# Altium schematic sheet iSystem.SchDoc
size A4; SheetNumber: 1; SheetTotal: 8
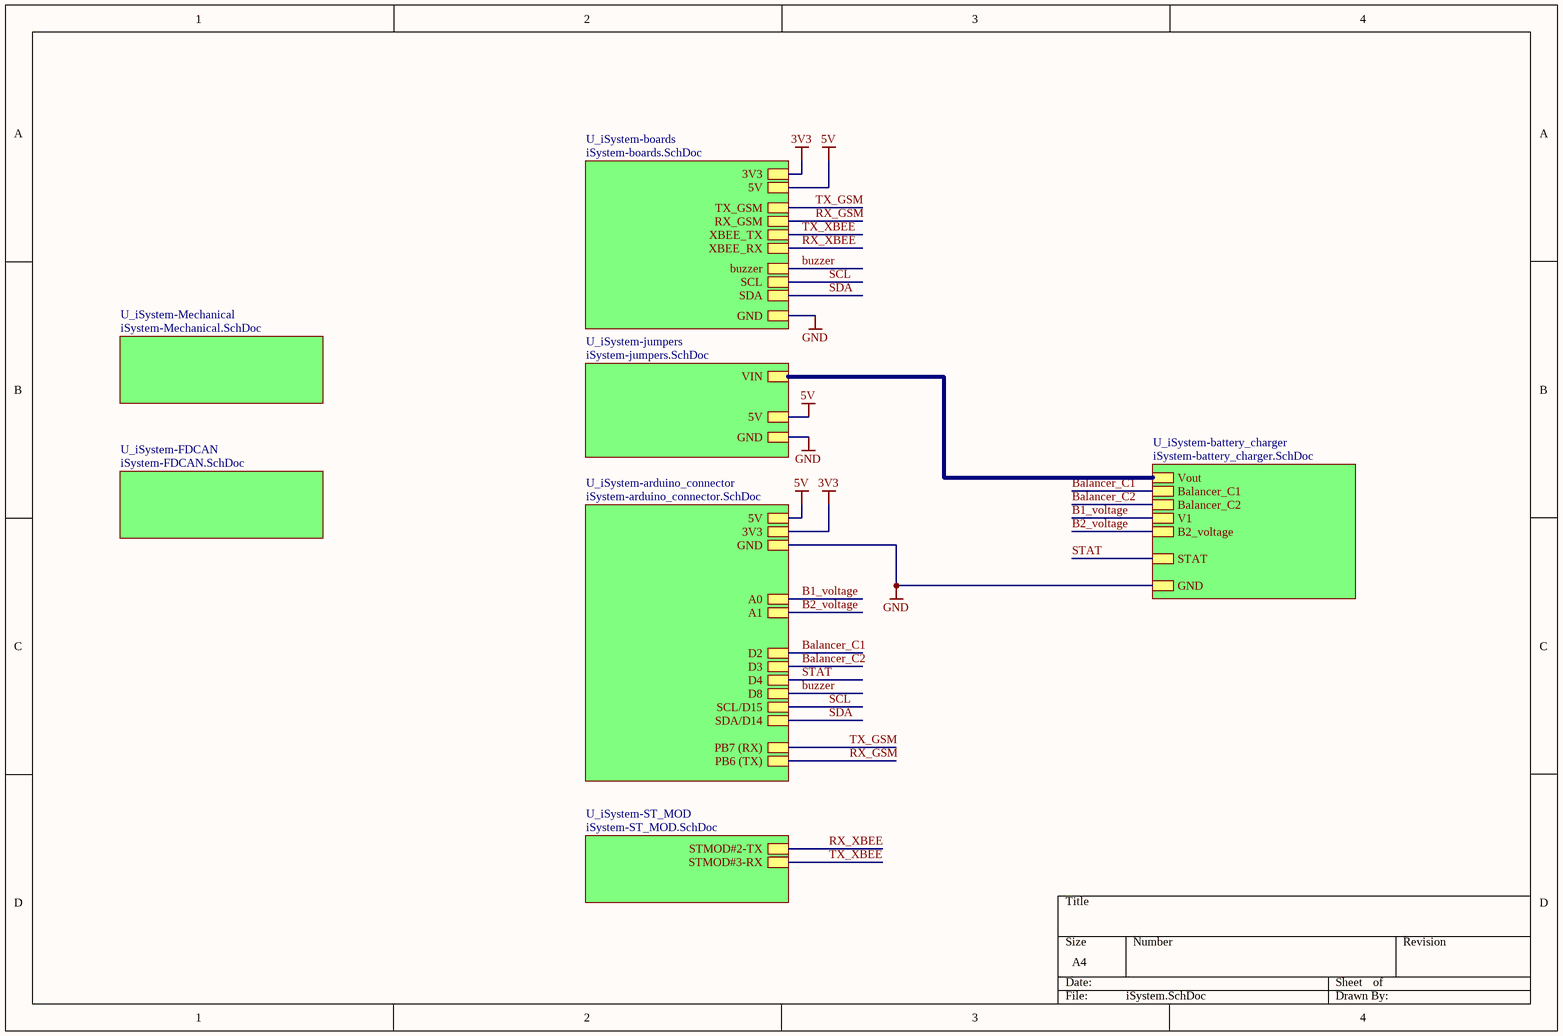
[diagram p0: iSystem.SchDoc]

## Sub-sheets
U_iSystem-arduino_connector = iSystem-arduino_connector.SchDoc: 3V3, 5V, GND, A0, A1, PB7 (RX), PB6 (TX), D2, D3, D4, D8, SCL/D15, SDA/D14
U_iSystem-battery_charger = iSystem-battery_charger.SchDoc: Vout, Balancer_C1, Balancer_C2, V1, GND, STAT, B2_voltage
U_iSystem-boards = iSystem-boards.SchDoc: 3V3, 5V, GND, TX_GSM, RX_GSM, buzzer, XBEE_TX, XBEE_RX, SCL, SDA
U_iSystem-FDCAN = iSystem-FDCAN.SchDoc: no entries
U_iSystem-jumpers = iSystem-jumpers.SchDoc: 5V, GND, VIN
U_iSystem-Mechanical = iSystem-Mechanical.SchDoc: no entries
U_iSystem-ST_MOD = iSystem-ST_MOD.SchDoc: STMOD#2-TX, STMOD#3-RX

## Nets
3V3: sheet U_iSystem-boards/3V3, sheet U_iSystem-arduino_connector/3V3
5V: sheet U_iSystem-boards/5V, sheet U_iSystem-jumpers/5V, sheet U_iSystem-arduino_connector/5V
GND: sheet U_iSystem-boards/GND, sheet U_iSystem-jumpers/GND, sheet U_iSystem-arduino_connector/GND, sheet U_iSystem-battery_charger/GND
B1_voltage: sheet U_iSystem-arduino_connector/A0, sheet U_iSystem-battery_charger/V1
B2_voltage: sheet U_iSystem-arduino_connector/A1, sheet U_iSystem-battery_charger/B2_voltage
Balancer_C1: sheet U_iSystem-arduino_connector/D2, sheet U_iSystem-battery_charger/Balancer_C1
Balancer_C2: sheet U_iSystem-arduino_connector/D3, sheet U_iSystem-battery_charger/Balancer_C2
buzzer: sheet U_iSystem-boards/buzzer, sheet U_iSystem-arduino_connector/D8
RX_GSM: sheet U_iSystem-boards/RX_GSM, sheet U_iSystem-arduino_connector/PB6 (TX)
RX_XBEE: sheet U_iSystem-boards/XBEE_RX, sheet U_iSystem-ST_MOD/STMOD#2-TX
SCL: sheet U_iSystem-boards/SCL, sheet U_iSystem-arduino_connector/SCL/D15
SDA: sheet U_iSystem-boards/SDA, sheet U_iSystem-arduino_connector/SDA/D14
STAT: sheet U_iSystem-arduino_connector/D4, sheet U_iSystem-battery_charger/STAT
TX_GSM: sheet U_iSystem-boards/TX_GSM, sheet U_iSystem-arduino_connector/PB7 (RX)
TX_XBEE: sheet U_iSystem-boards/XBEE_TX, sheet U_iSystem-ST_MOD/STMOD#3-RX
(unnamed): sheet U_iSystem-jumpers/VIN, sheet U_iSystem-battery_charger/Vout